# Altium schematic sheet board.SchDoc
size A4; SheetNumber: 2; SheetTotal: 2
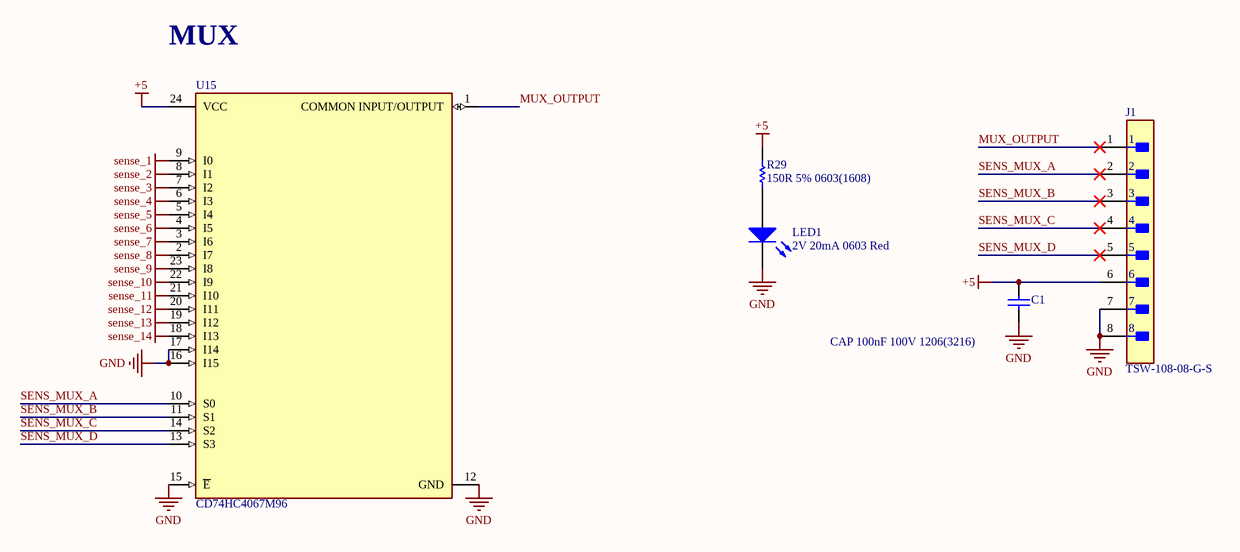
[diagram p0: board.SchDoc]

## Parts
C1  CAP 100nF 100V 1206(3216)  [CAPC1206(3216)150_N]
J1  TSW-108-08-G-S  [FP-TSW-108-08-G-S-MFG]
LED1  2V 20mA 0603 Red  [0603_A]
R29  150R 5% 0603(1608)  [RESC0603(1608)_L]
U15  CD74HC4067M96  [FP-DW0024A-MFG]

## Nets
+5: C1.1 J1.6 R29.2 U15.24(VCC)
GND: C1.2 J1.7 J1.8 LED1.1(K) U15.12(GND) U15.15(~{E}) U15.16(I15) U15.17(I14)
sense_1: U15.9(I0)
sense_2: U15.8(I1)
sense_3: U15.7(I2)
sense_4: U15.6(I3)
sense_5: U15.5(I4)
sense_6: U15.4(I5)
sense_7: U15.3(I6)
sense_8: U15.2(I7)
sense_9: U15.23(I8)
sense_10: U15.22(I9)
sense_11: U15.21(I10)
sense_12: U15.20(I11)
sense_13: U15.19(I12)
sense_14: U15.18(I13)
MUX_OUTPUT: J1.1 U15.1(COMMON_INPUT/OUTPUT)
SENS_MUX_A: J1.2 U15.10(S0)
SENS_MUX_B: J1.3 U15.11(S1)
SENS_MUX_C: J1.4 U15.14(S2)
SENS_MUX_D: J1.5 U15.13(S3)
NetLED1_2: LED1.2(A) R29.1

## Notes on the sheet
- MUX

## Library data of the parts
C1 = CMP-1037-04212-1: CAP 100nF 100V ±10% 1206 (3216 Metric) Thickness 1.45mm SMD; Case-EIA: 1206; Case-Metric: 3216; Tolerance: Â±10%; Value: 100nF; Technology: SMT; Max Thickness: 1.45 mm; Rated Voltage: 100 V
J1 = CMP-02766-000001-1: CONN HEADER VERT 8POS 2.54MM; Manufacturer: Samtec; Number Of Contacts: 8; Conn Orientation: Straight; Conn Gender: Male; Device Class L1: Connectors; ComponentLink2Description: Datasheet; Digikey Description: CONN HEADER VERT 8POS 2.54MM; ComponentLink2URL: http://suddendocs.samtec.com/catalog_english/tsw_th.pdf; Temperature: -55°C to +125°C; RoHS: TRUE; Mouser Description: TSW - Samtec 2.54mm Pin Header 13.46mm Overall Pin Length 5.08mm Tail; Automotive: No; Temperature Range High: +125°C; Package: TSW-108-08-G-S; Device Class L3: unset; Manufacturer Part Number: TSW-108-08-G-S; Pitch: 2.54mm; Number Of Rows: 1; Lead Free: Yes; Height: 8.71mm; Contact Material: Gold,Nickel; Footprint Url: http://suddendocs.samtec.com/prints/tsw-xxx-xx-x-x-xx-xxx-footprint.pdf; Temperature Range Low: -55°C; Octopart: https://octopart.com/tsw-108-08-g-s-samtec-272653; Category: Conn; Device Class L2: Headers and Wire Housings
LED1 = CMP-1426-00001-1: SMD mono-color Chip LED, WL-SMCW, Red; Manufacturer: Wuerth Elektronik; PartNumber: 150060RS75000; Color: Red; PackageReference: 0603_A; ComponentLink2URL: http://katalog.we-online.com/led/datasheet/150060RS75000.pdf; ComponentLink1URL: http://www.we-online.com; ComponentLink1Description: Manufacturer URL; ComponentLink2Description: Datasheet
R29 = CMP-1012-00054-1: 150R 0.1W 5% 0603 (1608 Metric)  SMD; Case-EIA: 0603; Value: 150.00 Ohm; Case-Metric: 1608; Power: 0.1 W; Tolerance: 5 %; Technology: SMT
U15 = CMP-04901-000007-1: IC MUX/DEMUX 1X16 24SOIC; Manufacturer: Texas Instruments; Standoff Height: 0.1mm; Logic Function Desc: Non-Inverting; Max Supply Voltage: 6V; Number Of Inputs: 16; Quiescent Current: 8uA; Number Of Circuits: 1; Propagation Delay: 6ns; Max Junction Temp: +150°C; Min Supply Voltage: 2V; ComponentLink2Description: Datasheet; Octopart: https://octopart.com/cd74hc4067m96-texas+instruments-722802; Ambient Temperature Range High: +125°C; Ipc Land Pattern Name: SOIC127P1030X265-24; Height: 2.65mm; Mouser Description: Multiplexer Switch ICs Hi-Spd CMOS 16Ch Anl Mltplxr/Demltplxr; Temperature Range Low: -55°C; Package: DW0024A; Temperature Range High: +125°C; Lead Free: Yes; ComponentLink2URL: http://www.ti.com/lit/ds/symlink/cd74hc4067.pdf; Manufacturer Part Number: CD74HC4067M96; RoHS: TRUE; Automotive: No; Device Class L1: Integrated Circuits (ICs); Digikey Description: IC MUX/DEMUX 1X16 24SOIC; Device Class L2: Logic ICs; Temperature: -55°C to +125°C; Device Class L3: Multiplexers; Category: IC; Ambient Temperature Range Low: -55°C; Number Of Outputs: 1